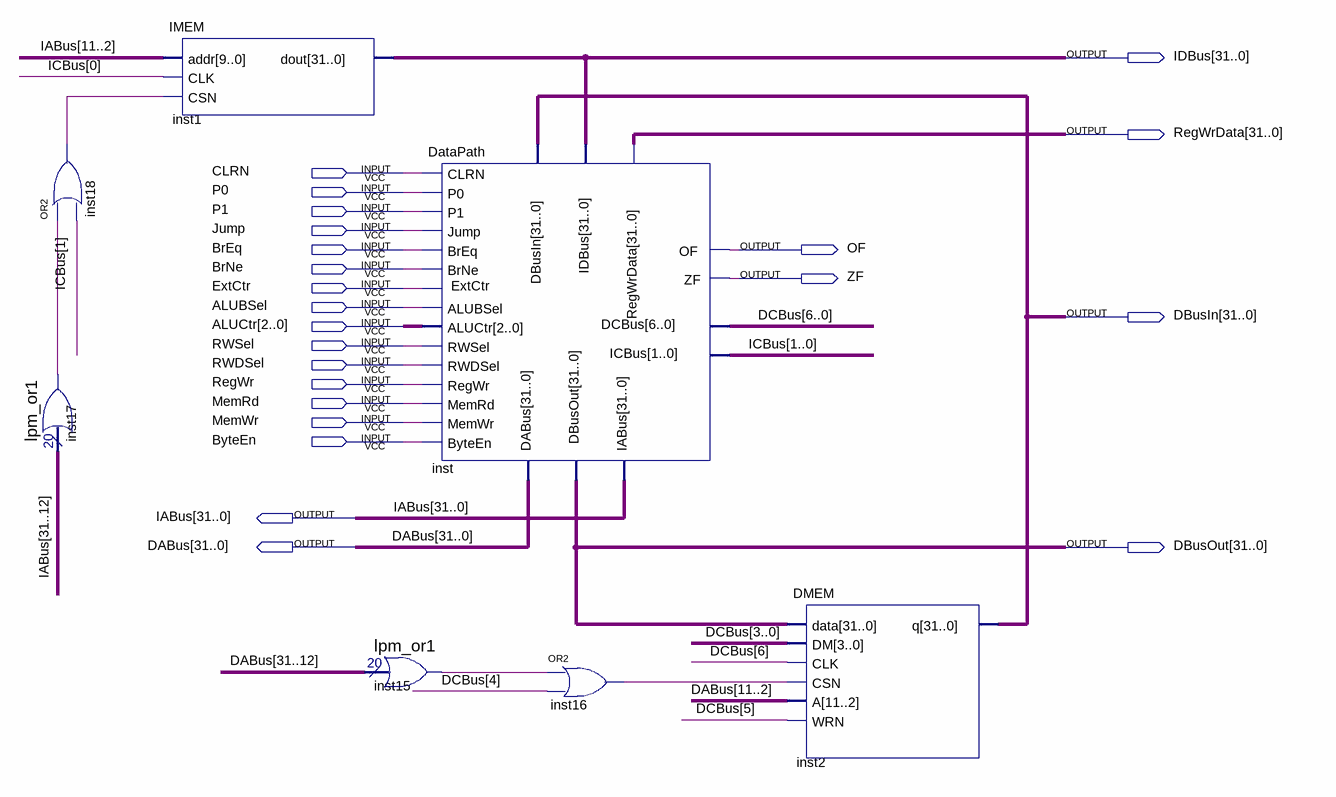
[diagram p0: schematic sheet]
// Quartus schematic DP_test.bdf as structural Verilog: 7 symbols, 23 pins
module DP_test (
  input  CLRN,
  input  P0,
  input  P1,
  input  Jump,
  input  BrEq,
  input  BrNe,
  input  ExtCtr,
  input  ALUBSel,
  input  [2:0] ALUCtr,
  input  RWSel,
  input  RWDSel,
  input  RegWr,
  input  MemRd,
  input  MemWr,
  input  ByteEn,
  output [31:0] IDBus,
  output [31:0] RegWrData,
  output OF,
  output ZF,
  output [31:0] DBusIn,
  output [31:0] IABus,
  output [31:0] DABus,
  output [31:0] DBusOut
);

  wire inst15_result, inst16_out, inst17_result, inst18_out;
  wire [1:0] ICBus;
  wire [6:0] DCBus;

  or inst18 (inst18_out, inst17_result, ICBus[1]);
  lpm_or1 inst17 (.data(IABus[31:12]), .result(inst17_result));
  IMEM inst1 (.addr(IABus[11:2]), .CLK(ICBus[0]), .CSN(inst18_out), .dout(IDBus));
  DataPath inst (
    .RWSel(RWSel), .ALUBSel(ALUBSel), .ALUCtr(ALUCtr), .RegWr(RegWr), .P0(P0), .CLRN(CLRN), .RWDSel(RWDSel),
    .DBusIn(DBusIn), .ByteEn(ByteEn), .MemRd(MemRd), .MemWr(MemWr), .P1(P1), .ExtCtr(ExtCtr), .BrEq(BrEq),
    .BrNe(BrNe), .Jump(Jump), .IDBus(IDBus), .OF(OF), .ZF(ZF), .DCBus(DCBus), .DABus(DABus),
    .DBusOut(DBusOut), .IABus(IABus), .ICBus(ICBus), .RegWrData(RegWrData));
  lpm_or1 inst15 (.data(DABus[31:12]), .result(inst15_result));
  or inst16 (inst16_out, inst15_result, DCBus[4]);
  DMEM inst2 (
    .data(DBusOut), .DM(DCBus[3:0]), .CLK(DCBus[6]), .CSN(inst16_out), .A(DABus[11:2]), .WRN(DCBus[5]),
    .q(DBusIn));
endmodule
